# EAGLE design dc_q84_v2 (EAGLE 9.6.2)
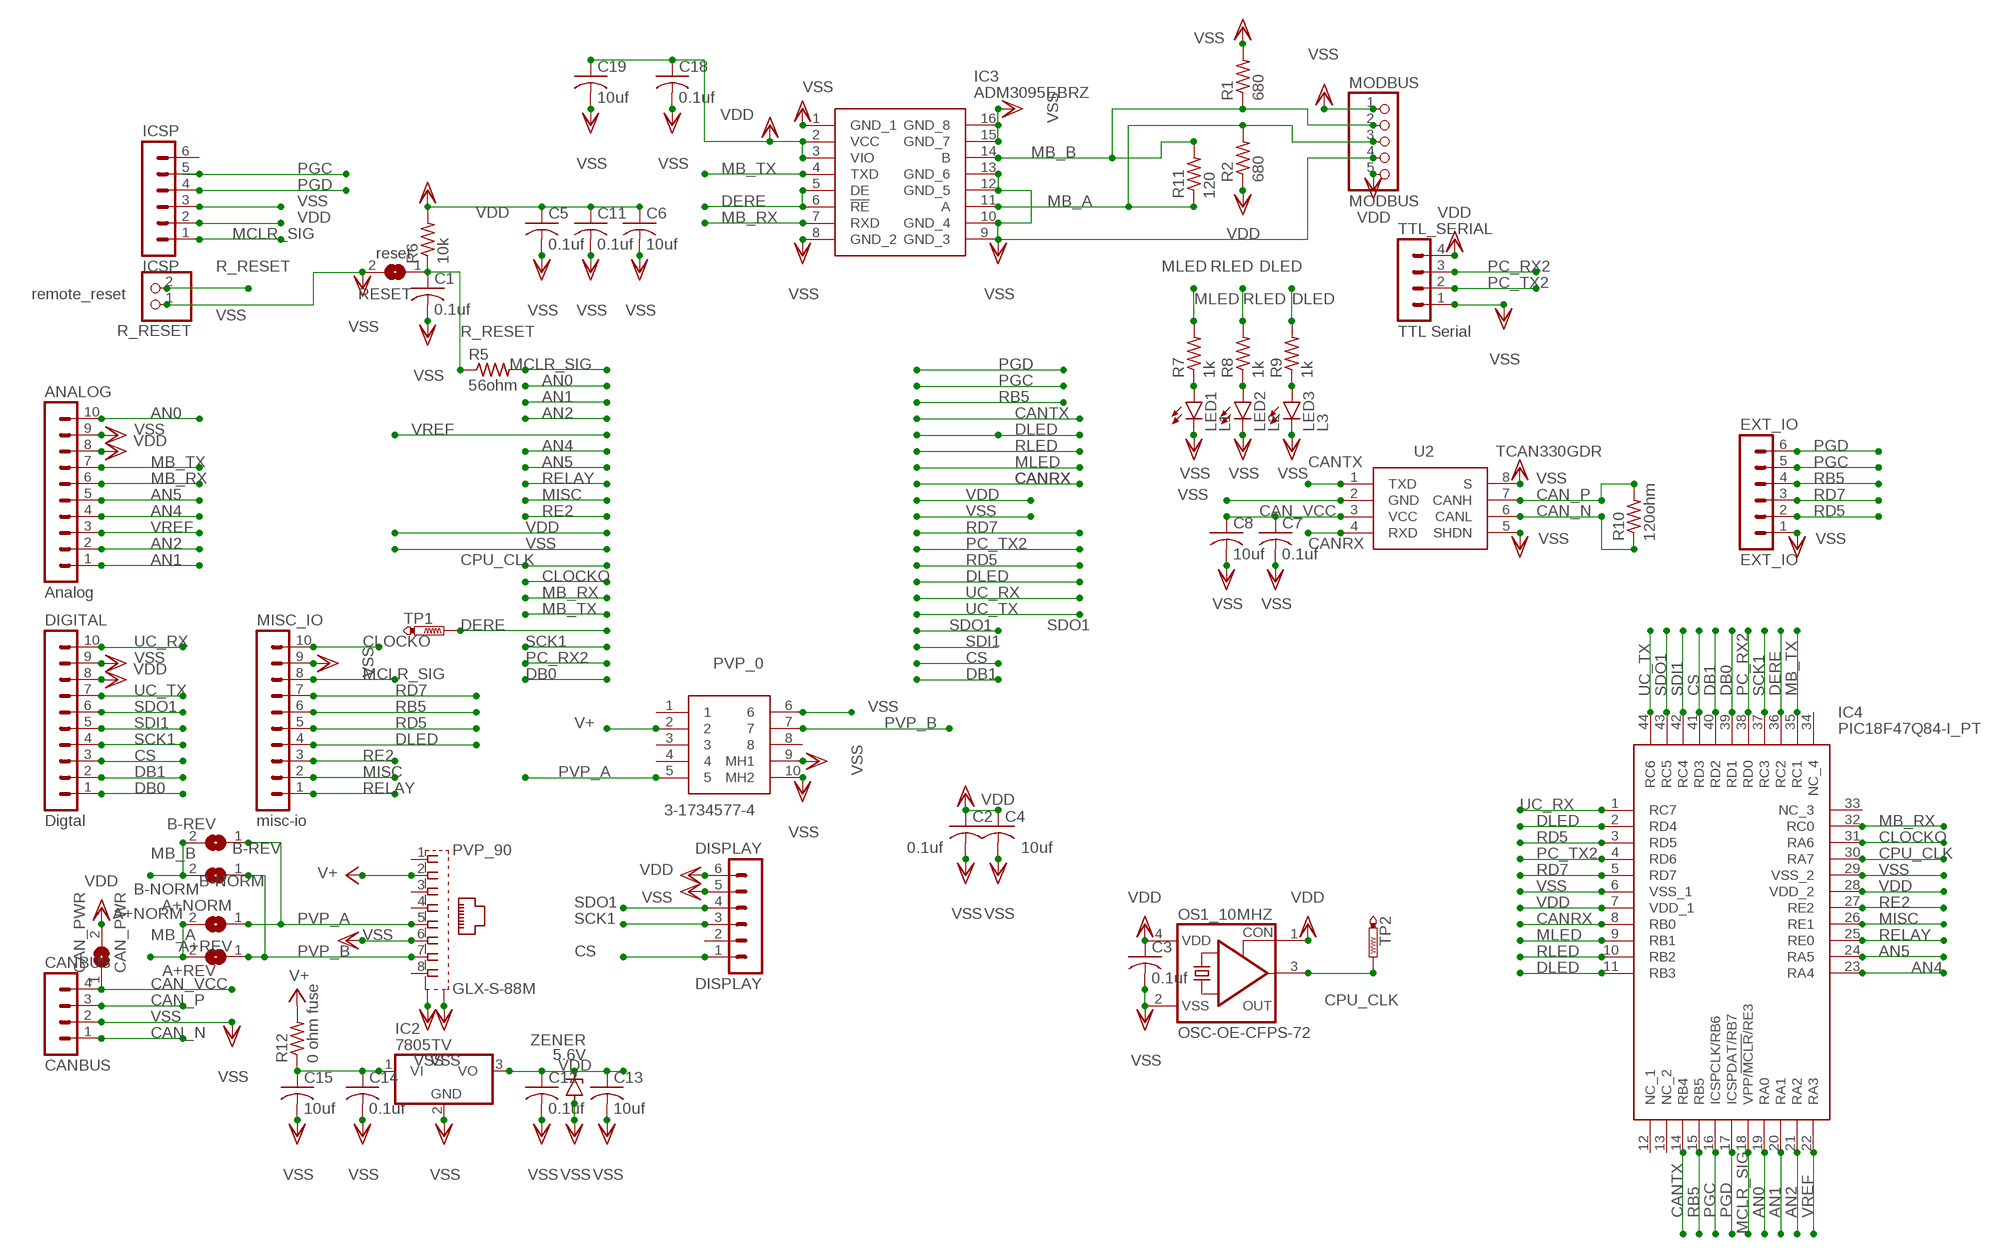
[diagram p0: schematic, sheet 1]

## Parts
A+NORM  A+NORM  SJ  [SJ]
A+REV  A+REV  SJ  [SJ]
ANALOG  Analog  MA10-1  [MA10-1]
B-NORM  B-NORM  SJ  [SJ]
B-REV  B-REV  SJ  [SJ]
C1  0.1uf  C-USC0805  [C0805]
C2  0.1uf  C-USC0805  [C0805]
C3  0.1uf  C-USC0805  [C0805]
C4  10uf  C-USC0805  [C0805]
C5  0.1uf  C-USC0805  [C0805]
C6  10uf  C-USC0805  [C0805]
C7  0.1uf  C-USC0805  [C0805]
C8  10uf  C-USC0805  [C0805]
C11  0.1uf  C-USC0805  [C0805]
C12  0.1uf  C-USC0805  [C0805]
C13  10uf  C-USC0805  [C0805]
C14  0.1uf  C-USC0805  [C0805]
C15  10uf  C-USC0805  [C0805]
C18  0.1uf  C-USC0805  [C0805]
C19  10uf  C-USC0805  [C0805]
CAN_PWR  CAN_PWR  SJ  [SJ]
CANBUS  CANBUS  MA04-1  [MA04-1]
DIGITAL  Digtal  MA10-1  [MA10-1]
DISPLAY  DISPLAY  MA06-1  [MA06-1]
EXT_IO  EXT_IO  MA06-1  [MA06-1]
IC2  7805TV  [TO220V]
IC3  ADM3095EBRZ  [SOIC127P600X175-16N]
IC4  PIC18F47Q84-I_PT  [QFP80P1200X1200X120-44N]
ICSP  ICSP  MA06-1  [MA06-1]
LED1  L1  LEDCHIPLED_0805  [CHIPLED_0805]
LED2  L2  LEDCHIPLED_0805  [CHIPLED_0805]
LED3  L3  LEDCHIPLED_0805  [CHIPLED_0805]
MISC_IO  misc-io  MA10-1  [MA10-1]
MODBUS  MODBUS  PINHD-1X5  [1X05]
OS1_10MHZ  OSC-OE-CFPS-72  [7.2X5.2-4-PAD]
PVP_0  3-1734577-4  [317345774]
PVP_90  GLX-S-88M  [GLX-S-88M]
R1  680  R-US_R0805  [R0805]
R2  680  R-US_R0805  [R0805]
R5  56ohm  R-US_R0805  [R0805]
R6  10k  R-US_R0805  [R0805]
R7  1k  R-US_R0805  [R0805]
R8  1k  R-US_R0805  [R0805]
R9  1k  R-US_R0805  [R0805]
R10  120ohm  R-US_R0805  [R0805]
R11  120  R-US_R0805  [R0805]
R12  0 ohm fuse  R-US_R1206  [R1206]
R_RESET  remote_reset  PINHD-1X2  [1X02]
RESET  reset  SJ  [SJ]
TP1  PTR1PAD1-13  [P1-13]
TP2  PTR1PAD1-13  [P1-13]
TTL_SERIAL  TTL Serial  MA04-1  [MA04-1]
U2  TCAN330GDR  [SOIC127P600X175-8N]
ZENER  5.6V  ZENER-DIODESMB  [SMB]

## Nets
AN0: ANALOG.10 IC4.19(RA0)
AN1: ANALOG.1 IC4.20(RA1)
AN2: ANALOG.2 IC4.21(RA2)
AN4: ANALOG.4 IC4.23(RA4)
AN5: ANALOG.5 IC4.24(RA5)
CAN_N: CANBUS.1 R10.1 U2.6(CANL)
CAN_P: CANBUS.3 R10.2 U2.7(CANH)
CAN_VCC: C7.1 C8.1 CAN_PWR.1 CANBUS.4 U2.3(VCC)
CANRX: IC4.8(RB0) U2.4(RXD)
CANTX: IC4.14(RB4) U2.1(TXD)
CLOCKO: IC4.31(RA6) MISC_IO.10
CPU_CLK: IC4.30(RA7) OS1_10MHZ.3(OUT) TP2.TP
CS: DIGITAL.3 DISPLAY.1 IC4.41(RD3)
DB0: DIGITAL.1 IC4.39(RD1)
DB1: DIGITAL.2 IC4.40(RD2)
DERE: IC3.5(DE) IC3.6(!RE) IC4.36(RC2) TP1.TP
DLED: IC4.2(RD4) IC4.11(RB3) MISC_IO.4 R9.2
MB_A: A+NORM.2 A+REV.2 IC3.11(A) MODBUS.3 R2.2 R11.1
MB_B: B-NORM.2 B-REV.2 IC3.14(B) MODBUS.2 R1.1 R11.2
MB_RX: ANALOG.6 IC3.7(RXD) IC4.32(RC0)
MB_TX: ANALOG.7 IC3.4(TXD) IC4.35(RC1)
MCLR_SIG: IC4.18(VPP/!MCLR!/RE3) ICSP.1 MISC_IO.8 R5.2
MISC: IC4.26(RE1) MISC_IO.2
MLED: IC4.9(RB1) R7.2
N$2: C14.1 C15.1 IC2.1(VI) R12.1
N$4: LED1.A R7.1
N$5: LED2.A R8.1
N$6: LED3.A R9.1
PC_RX2: IC4.38(RD0) TTL_SERIAL.3
PC_TX2: IC4.4(RD6) TTL_SERIAL.2
PGC: EXT_IO.5 IC4.16(ICSPCLK/RB6) ICSP.5
PGD: EXT_IO.6 IC4.17(ICSPDAT/RB7) ICSP.4
PVP_A: A+NORM.1 B-REV.1 PVP_0.5 PVP_90.5
PVP_B: A+REV.1 B-NORM.1 PVP_0.7 PVP_90.7
R_RESET: C1.1 R5.1 R6.1 R_RESET.2 RESET.1
RB5: EXT_IO.4 IC4.15(RB5) MISC_IO.6
RD5: EXT_IO.2 IC4.3(RD5) MISC_IO.5
RD7: EXT_IO.3 IC4.5(RD7) MISC_IO.7
RE2: IC4.27(RE2) MISC_IO.3
RELAY: IC4.25(RE0) MISC_IO.1
RLED: IC4.10(RB2) R8.2
SCK1: DIGITAL.4 DISPLAY.3 IC4.37(RC3)
SDI1: DIGITAL.5 IC4.42(RC4)
SDO1: DIGITAL.6 DISPLAY.4 IC4.43(RC5)
UC_RX: DIGITAL.10 IC4.1(RC7)
UC_TX: DIGITAL.7 IC4.44(RC6)
V+ [icurrent]: PVP_0.2 PVP_90.2 R12.2
VDD: ANALOG.8 C2.1 C3.1 C4.1 C5.1 C6.1 C11.1 C12.1 C13.1 C18.1 C19.1 CAN_PWR.2 DIGITAL.8 DISPLAY.6 IC2.3(VO) IC3.2(VCC) IC3.3(VIO) IC4.7(VDD_1) IC4.28(VDD_2) ICSP.2 MODBUS.5 OS1_10MHZ.1(CON) OS1_10MHZ.4(VDD) R2.1 R6.2 TTL_SERIAL.4 ZENER.C
VREF: ANALOG.3 IC4.22(RA3)
VSS: ANALOG.9 C1.2 C2.2 C3.2 C4.2 C5.2 C6.2 C7.2 C8.2 C11.2 C12.2 C13.2 C14.2 C15.2 C18.2 C19.2 CANBUS.2 DIGITAL.9 DISPLAY.5 EXT_IO.1 IC2.2(GND) IC3.1(GND_1) IC3.8(GND_2) IC3.9(GND_3) IC3.10(GND_4) IC3.12(GND_5) IC3.13(GND_6) IC3.15(GND_7) IC3.16(GND_8) IC4.6(VSS_1) IC4.29(VSS_2) ICSP.3 LED1.C LED2.C LED3.C MISC_IO.9 MODBUS.1 MODBUS.4 OS1_10MHZ.2(VSS) PVP_0.6 PVP_0.9(MH1) PVP_0.10(MH2) PVP_90.6 PVP_90.S1 PVP_90.S2 R1.2 R_RESET.1 RESET.2 TTL_SERIAL.1 U2.2(GND) U2.5(SHDN) U2.8(S) ZENER.A
Unconnected: DISPLAY.2 IC4.12(NC_1) IC4.13(NC_2) IC4.33(NC_3) IC4.34(NC_4) ICSP.6 PVP_0.1 PVP_0.3 PVP_0.4 PVP_0.8 PVP_90.1 PVP_90.3 PVP_90.4 PVP_90.8

## Library data of the parts
A+NORM A+REV B-NORM B-REV CAN_PWR RESET = jumper:SJ: SMD solder JUMPER
ANALOG DIGITAL MISC_IO = con-lstb:MA10-1: PIN HEADER; OC_FARNELL: unknown; OC_NEWARK: unknown
C1-C8 C11-C15 C18 C19 = rcl:C-US: CAPACITOR, American symbol; SPICEPREFIX: C
CANBUS TTL_SERIAL = con-lstb:MA04-1: PIN HEADER; OC_FARNELL: unknown; OC_NEWARK: unknown
DISPLAY EXT_IO ICSP = con-lstb:MA06-1: PIN HEADER; OC_FARNELL: unknown; OC_NEWARK: unknown
IC2 = linear:78*: Positive VOLTAGE REGULATOR Source: http://cache.national.com/ds/LM/LM78L05.pdf http://www.fairchildsemi.com/ds/LM/LM7805.pdf
IC3 = ADM3095EBRZ:ADM3095EBRZ: Level 4 EMC Protected RS-485 Transceiver with Full +/-42 V Fault Protection Source: Datasheet; DESCRIPTION: Level 4 EMC Protected RS-485 Transceiver with Full +/-42 V Fault Protection; HEIGHT: 1.75mm; MANUFACTURER_NAME: Analog Devices; MANUFACTURER_PART_NUMBER: ADM3095EBRZ; MOUSER_PART_NUMBER: 584-ADM3095EBRZ; MOUSER_PRICE-STOCK: https://www.mouser.com/Search/Refine.aspx?Keyword=584-ADM3095EBRZ
IC4 = PIC18F47Q84-I_PT:PIC18F47Q84-I_PT: 8-bit Microcontrollers - MCU CAN-FD, 128KB Flash, 13KB RAM, 12b ADC3, UTMR, DAC, Comp, PWM, CCP, CWG, HLT, WWDT, SCAN/CRC, ZCD, PPS,Comms IDLE/DOZE/PMD, JTAG Source: Datasheet; DESCRIPTION: 8-bit Microcontrollers - MCU CAN-FD, 128KB Flash, 13KB RAM, 12b ADC3, UTMR, DAC, Comp, PWM, CCP, CWG, HLT, WWDT, SCAN/CRC, ZCD, PPS,Comms IDLE/DOZE/PMD, JTAG; HEIGHT: 1.2mm; MANUFACTURER_NAME: Microchip; MANUFACTURER_PART_NUMBER: PIC18F47Q84-I/PT; MOUSER_PART_NUMBER: 579-PIC18F47Q84-I/PT; MOUSER_PRICE-STOCK: https://www.mouser.co.uk/ProductDetail/Microchip-Technology/PIC18F47Q84-I-PT?qs=d0WKAl%252BL4KYthTnAmf%2FYSg%3D%3D
LED1-LED3 = led:LED: LED OSRAM: - CHIPLED LG R971, LG N971, LY N971, LG Q971, LY Q971, LO R971, LY R971 LH N974, LH R974 LS Q976, LO Q976, LY Q976 LO Q996 - Hyper CHIPLED LW Q18S LB Q993, LB Q99A, LB R99A - SideLED LS A670, LO A670, LY A670, LG A670, LP A670 LB A673, LV A673, LT A673, LW A673 LH A674 LY A675 LS A676, LA A676, LO A676, LY A676, LW A676 LS A679, LY A679, LG A679 - Hyper Micro SIDELED® LS Y876, LA Y876, LO Y876, LY Y876 LT Y87S - SmartLED LW L88C, LW L88S LB L89C, LB L89S, LG L890 LS L89K, LO L89K, LY L89K LS L896, LA L896, LO L896, LY L896 - TOPLED LS T670, LO T670, LY T670, LG T670, LP T670 LSG T670, LSP T670, LSY T670, LOP T670, LYG T670 LG T671, LOG T671, LSG T671 LB T673, LV T673, LT T673, LW T673 LH T674 LS T676, LA T676, LO T676, LY T676, LB T676, LH T676, LSB T676, LW T676 LB T67C, LV T67C, LT T67C, LS T67K, LO T67K, LY T67K, LW E67C LS E67B, LA E67B, LO E67B, LY E67B, LB E67C, LV E67C, LT E67C LW T67C LS T679, LY T679, LG T679 LS T770, LO T770, LY T770, LG T770, LP T770 LB T773, LV T773, LT T773, LW T773 LH T774 LS E675, LA E675, LY E675, LS T675 LS T776, LA T776, LO T776, LY T776, LB T776 LHGB T686 LT T68C, LB T68C - Hyper Mini TOPLED® LB M676 - Mini TOPLED Santana® LG M470 LS M47K, LO M47K, LY M47K Source: http://www.osram.convergy.de LUXEON: - LUMILED® LXK2-PW12-R00, LXK2-PW12-S00, LXK2-PW14-U00, LXK2-PW14-V00 LXK2-PM12-R00, LXK2-PM12-S00, LXK2-PM14-U00 LXK2-PE12-Q00, LXK2-PE12-R00, LXK2-PE12-S00, LXK2-PE14-T00, LXK2-PE14-U00 LXK2-PB12-K00, LXK2-PB12-L00, LXK2-PB12-M00, LXK2-PB14-N00, LXK2-PB14-P00, LXK2-PB14-Q00 LXK2-PR12-L00, LXK2-PR12-M00, LXK2-PR14-Q00, LXK2-PR14-R00 LXK2-PD12-Q00, LXK2-PD12-R00, LXK2-PD12-S00 LXK2-PH12-R00, LXK2-PH12-S00 LXK2-PL12-P00, LXK2-PL12-Q00, LXK2-PL12-R00 Source: www.luxeon.com KINGBRIGHT: KA-3528ASYC Source: www.kingbright.com
MODBUS = pinhead:PINHD-1X5: PIN HEADER
OS1_10MHZ = IQD-Frequency-Products:OSC-OE: OSCILLATOR WITH OE
PVP_0 = 3-1734577-4:3-1734577-4: RJ45 Connector, Single Port, 1 x 1, Standard Connector Contact Density, Jack, Shielded, Cat 3, Standard - Latch Down, 8 Position, Standard Profile Source: Datasheet; DESCRIPTION: RJ45 Connector, Single Port, 1 x 1, Standard Connector Contact Density, Jack, Shielded, Cat 3, Standard - Latch Down, 8 Position, Standard Profile; HEIGHT: 16.8mm; MANUFACTURER_NAME: TE Connectivity; MANUFACTURER_PART_NUMBER: 3-1734577-4; MOUSER_PART_NUMBER: 571-3-1734577-4; MOUSER_PRICE-STOCK: https://www.mouser.co.uk/ProductDetail/TE-Connectivity-AMP/3-1734577-4?qs=Z4JOKa0a9TUSCOA052xCCw%3D%3D
PVP_90 = con-kycon:GLX-S-88M: Mod. Jack, Right Angle, 8 posiotion, 8 contatcs RJ45 Source: GLX-S-88M.pdf; OC_FARNELL: unknown; OC_NEWARK: unknown
R1 R2 R5-R12 = rcl:R-US_: RESISTOR, American symbol; SPICEPREFIX: R
R_RESET = pinhead:PINHD-1X2: PIN HEADER
TP1 TP2 = testpad:PTR1: TEST PIN
U2 = TCAN330GDR:TCAN330GDR: 3.3-V CAN Transceivers with CAN FD (Flexible Data Rate) Source: Datasheet; DESCRIPTION: 3.3-V CAN Transceivers with CAN FD (Flexible Data Rate); HEIGHT: 1.75mm; MANUFACTURER_NAME: Texas Instruments; MANUFACTURER_PART_NUMBER: TCAN330GDR; MOUSER_PART_NUMBER: 595-TCAN330GDR; MOUSER_PRICE-STOCK: https://www.mouser.co.uk/ProductDetail/Texas-Instruments/TCAN330GDR?qs=9DwIlvx97adeWwzxdqwSPw%3D%3D
ZENER = diode:ZENER-DIODE: Z-Diode

## Net classes
1 icurrent: width 0.305 mm

## Board
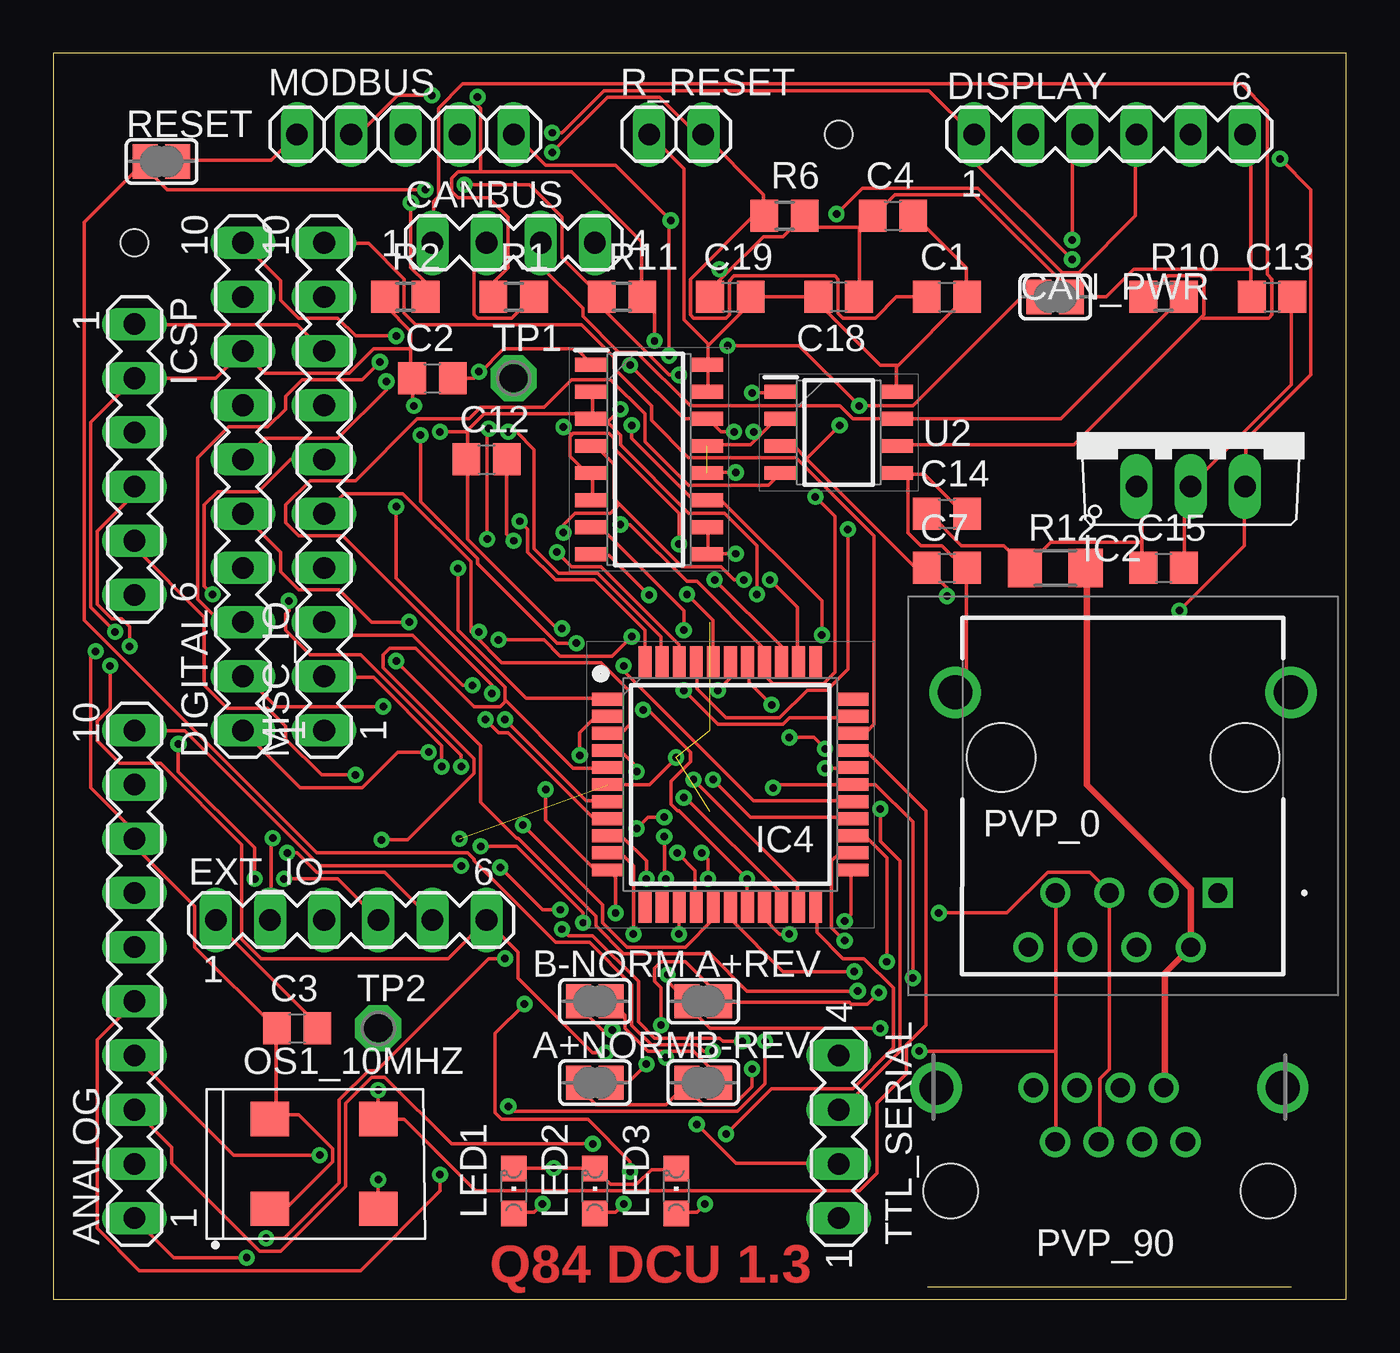
[diagram p1: board, top side]
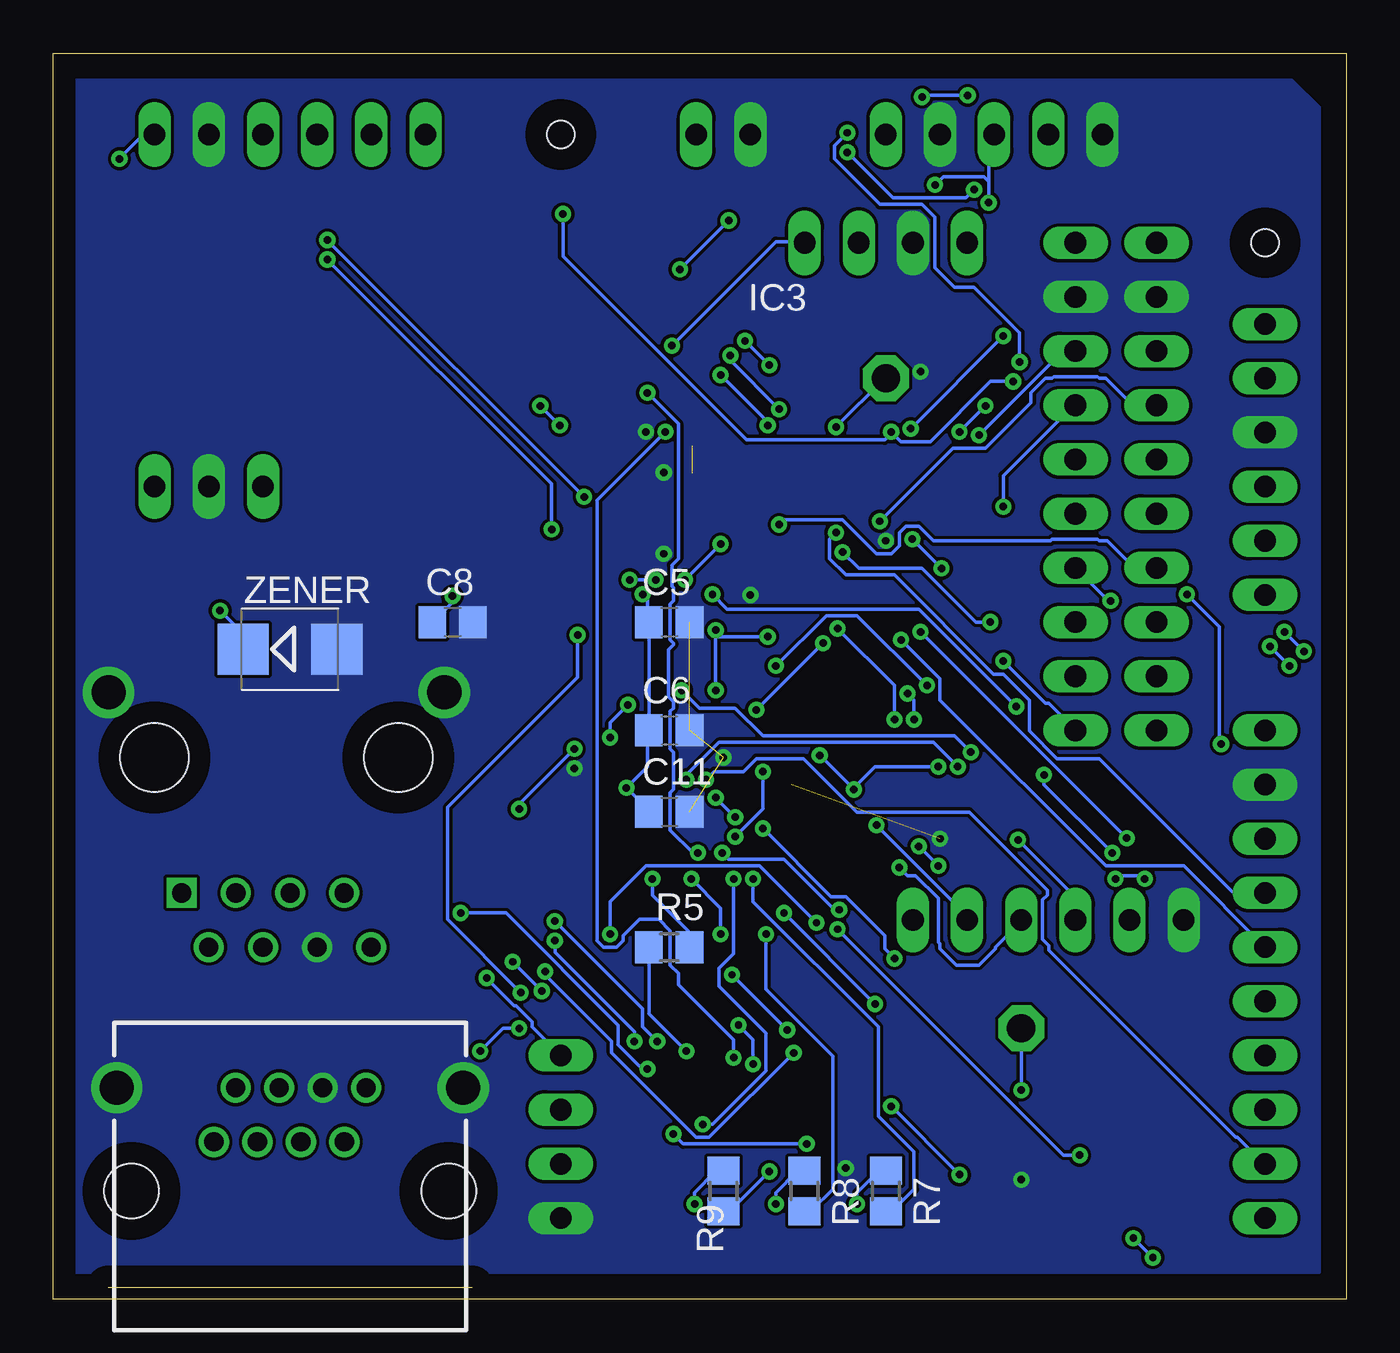
[diagram p2: board, bottom side, seen from below]

Size 60.63 x 58.41 mm. Coordinates in mm from the lower left corner, seen from the top.
Outline: 0,0 60.63,0 60.63,58.41 0,58.41 0,0
Copper layers (1*16): Top 0.035mm / dielectric 1.5mm / Bottom 0.035mm
Design rules "default": minimum track width 6mil, minimum drill 0.35mm, track to track 6mil, track to pad 6mil, pad to pad 6mil, via to via 6mil, smd to smd 6mil, copper to edge 40mil, drill to drill 6mil, minimum pad ring 10mil, minimum via ring 8mil, stop-mask expansion 4mil, vias tented up to drill 0mil, thermal gap 10mil
Holes 1.27 mm at 36.83,54.61 3.81,49.53

### Footprints (pad centres in the part's own frame; a part is rotated, then mirrored left to right if it is on the bottom)
SJ = smd 1.168 x 1.6: 1 -0.762,0; 2 0.762,0
MA10-1 = drill 1.016 long: 1 -11.43,0; 2 -8.89,0; 3 -6.35,0; 4 -3.81,0; 5 -1.27,0; 6 1.27,0; 7 3.81,0; 8 6.35,0; 9 8.89,0; 10 11.43,0
C0805 = smd 1.3 x 1.5: 1 -0.95,0; 2 0.95,0
MA04-1 = drill 1.016 long: 1 -3.81,0; 2 -1.27,0; 3 1.27,0; 4 3.81,0
MA06-1 = drill 1.016 long: 1 -6.35,0; 2 -3.81,0; 3 -1.27,0; 4 1.27,0; 5 3.81,0; 6 6.35,0
TO220V = drill 1.016 long: 1 -2.54,-2.54; 2 0,-2.54; 3 2.54,-2.54
SOIC127P600X175-16N = smd 1.525 x 0.65: 1 -2.712,4.445; 2 -2.712,3.175; 3 -2.712,1.905; 4 -2.712,0.635; 5 -2.712,-0.635; 6 -2.712,-1.905; 7 -2.712,-3.175; 8 -2.712,-4.445; 9 2.712,-4.445; 10 2.712,-3.175; 11 2.712,-1.905; 12 2.712,-0.635; 13 2.712,0.635; 14 2.712,1.905; 15 2.712,3.175; 16 2.712,4.445
QFP80P1200X1200X120-44N = smd 1.475 x 0.6: 1 -5.738,4; 2 -5.738,3.2; 3 -5.738,2.4; 4 -5.738,1.6; 5 -5.738,0.8; 6 -5.738,0; 7 -5.738,-0.8; 8 -5.738,-1.6; 9 -5.738,-2.4; 10 -5.738,-3.2; 11 -5.738,-4; 23 5.738,-4; 24 5.738,-3.2; 25 5.738,-2.4; 26 5.738,-1.6; 27 5.738,-0.8; 28 5.738,0; 29 5.738,0.8; 30 5.738,1.6; 31 5.738,2.4; 32 5.738,3.2; 33 5.738,4 | smd 0.6 x 1.475: 12 -4,-5.738; 13 -3.2,-5.738; 14 -2.4,-5.738; 15 -1.6,-5.738; 16 -0.8,-5.738; 17 0,-5.738; 18 0.8,-5.738; 19 1.6,-5.738; 20 2.4,-5.738; 21 3.2,-5.738; 22 4,-5.738; 34 4,5.738; 35 3.2,5.738; 36 2.4,5.738; 37 1.6,5.738; 38 0.8,5.738; 39 0,5.738; 40 -0.8,5.738; 41 -1.6,5.738; 42 -2.4,5.738; 43 -3.2,5.738; 44 -4,5.738
CHIPLED_0805 = smd 1.2 x 1.2: A 0,-1.05; C 0,1.05
1X05 = drill 1.016 long: 1 -5.08,0; 2 -2.54,0; 3 0,0; 4 2.54,0; 5 5.08,0
7.2X5.2-4-PAD = smd 1.8 x 1.6: 1 -2.54,-2.1; 2 2.54,-2.1; 3 2.54,2.1; 4 -2.54,2.1
317345774 = drill 0.9 pad 1.4 square: 1 0,0 | drill 0.9 pad 1.4: 2 -1.27,-2.54; 3 -2.54,0; 4 -3.81,-2.54; 5 -5.08,0; 6 -6.35,-2.54; 7 -7.62,0; 8 -8.89,-2.54 | drill 1.6 pad 2.4: 9 3.43,9.4; 10 -12.32,9.4 | hole 3.2: 1.27,6.35; -10.16,6.35
GLX-S-88M = drill 0.9 pad 1.422: 1 -3.57,-2.3; 2 -2.55,-4.84; 3 -1.53,-2.3; 4 -0.51,-4.84; 5 0.51,-2.3; 6 1.53,-4.84; 7 2.55,-2.3; 8 3.57,-4.84 | drill 1.6 pad 2.184: S1 -8.125,-4.84; S2 8.125,-4.84 | hole 2.55: -7.44,0; 7.44,0
R0805 = smd 1.3 x 1.5: 1 -0.95,0; 2 0.95,0
R1206 = smd 1.6 x 1.803: 1 -1.422,0; 2 1.422,0
1X02 = drill 1.016 long: 1 -1.27,0; 2 1.27,0
P1-13 = drill 1.321 pad 2.159 octagon: TP 0,0
SOIC127P600X175-8N = smd 1.528 x 0.65: 1 -2.711,1.905; 2 -2.711,0.635; 3 -2.711,-0.635; 4 -2.711,-1.905; 5 2.711,-1.905; 6 2.711,-0.635; 7 2.711,0.635; 8 2.711,1.905
SMB = smd 2.4 x 2.4: A 2.2,0; C -2.2,0

### Placement (x,y rotation side)
A+NORM  25.4,10.16 0 top
A+REV  30.48,13.97 0 top
ANALOG  3.81,15.24 90 top
B-NORM  25.4,13.97 0 top
B-REV  30.48,10.16 0 top
C1  41.91,46.99 0 top
C2  17.78,43.18 0 top
C3  11.43,12.7 0 top
C4  39.37,50.8 0 top
C5  31.75,31.75 0 bottom
C6  31.75,26.67 0 bottom
C7  41.91,34.29 0 top
C8  41.91,31.75 0 bottom
C11  31.75,22.86 0 bottom
C12  20.32,39.37 0 top
C13  57.15,46.99 0 top
C14  41.91,36.83 0 top
C15  52.07,34.29 0 top
C18  36.83,46.99 180 top
C19  31.75,46.99 0 top
CAN_PWR  46.99,46.99 0 top
CANBUS  21.59,49.53 0 top
DIGITAL  8.89,38.1 90 top
DISPLAY  49.53,54.61 0 top
EXT_IO  13.97,17.78 0 top
IC2  53.34,40.64 0 top
IC3  27.94,39.37 0 top
IC4  31.75,24.13 0 top
ICSP  3.81,39.37 270 top
LED1  21.59,5.08 0 top
LED2  25.4,5.08 0 top
LED3  29.21,5.08 0 top
MISC_IO  12.7,38.1 90 top
MODBUS  16.51,54.61 0 top
OS1_10MHZ  12.7,6.35 0 top
PVP_0  54.61,19.05 0 top
PVP_90  49.53,5.08 180 top
R1  21.59,46.99 0 top
R2  16.51,46.99 0 top
R5  31.75,16.51 0 bottom
R6  34.29,50.8 0 top
R7  21.59,5.08 270 bottom
R8  25.4,5.08 270 bottom
R9  29.21,5.08 270 bottom
R10  52.07,46.99 0 top
R11  26.67,46.99 0 top
R12  46.99,34.29 0 top
R_RESET  29.21,54.61 0 top
RESET  5.08,53.34 0 top
TP1  21.59,43.18 0 top
TP2  15.24,12.7 0 top
TTL_SERIAL  36.83,7.62 90 top
U2  36.83,40.64 0 top
ZENER  49.53,30.48 0 bottom

### Tracks (layer width: path | path; a pad name or v marks a point on that pad's centre or on a via)
AN0  (via drill 0.35)
  Top 0.152: v34.52,17.12 34.06,17.12 33.38,17.81 33.38,18.34 IC4.19 | v24.84,17.65 24.84,18.11 21.72,21.23 v20.04,21.23 | v19.13,20.32 12.5,20.32 6.17,26.64 3.81,26.64 ANALOG.10
  Bottom 0.152: v34.52,17.12 34.52,18.64 32.84,20.32 27.51,20.32 v24.84,17.65 | v19.13,20.32 v20.04,21.23
AN1  (via drill 0.35)
  Top 0.152: v29.57,23.52 29.64,23.52 34.14,19.03 34.14,18.42 IC4.20 | v28.65,22.61 27.89,22.61 v27.36,22.07 | v21.18,15.98 20.42,15.98 15.16,10.72 14.78,10.72 13.41,9.35 13.41,5.46 10.82,2.87 v9.98,2.87 | v9.07,1.96 5.64,1.96 3.81,3.79 ANALOG.1
  Bottom 0.152: v28.65,22.61 v29.57,23.52 | v27.36,22.07 24.16,18.87 23.47,18.87 21.64,17.04 21.64,16.43 v21.18,15.98 | v9.07,1.96 v9.98,2.87
AN2  (via drill 0.35)
  Top 0.152: v30.02,24.36 34.9,19.48 34.9,18.42 IC4.21
  Bottom 0.152: v30.02,24.36 29.64,24.74 28.27,24.74 27.66,25.35 25.45,25.35 22.94,22.83 17.68,22.83 14.02,19.18 14.02,18.95 14.25,18.72 14.25,16.89 13.95,16.59 13.95,16.36 5.18,7.59 5.11,7.59 3.81,6.3 ANALOG.2
AN4  (via drill 0.35)
  Top 0.152: v37.11,17.73 37.41,18.03 37.41,20.09 IC4.23 | v32.31,12.09 31.39,12.09 31.24,12.24 28.19,12.24 27.43,13 27.43,14.91 25.3,17.04 24.16,17.04 v23.85,17.35 | v12.5,6.76 8.46,6.76 3.81,11.4 ANALOG.4
  Bottom 0.152: v37.11,17.73 32.99,13.61 32.99,12.78 v32.31,12.09 | v23.85,17.35 13.26,6.76 v12.5,6.76
AN5  (via drill 0.35)
  Top 0.152: v37.11,16.82 36.5,17.42 36.5,20.55 36.88,20.93 37.41,20.93 IC4.24 | v33.38,12.09 33.38,10.11 32.08,8.81 21.57,8.81 v21.34,9.04 | v18.14,5.84 18.14,5.08 14.4,1.35 4.04,1.35 2.06,3.33 2.06,12.17 3.81,13.92 ANALOG.5
  Bottom 0.152: v37.11,16.82 37.11,16.28 33.38,12.55 v33.38,12.09 | v18.14,5.84 v21.34,9.04
CAN_N
  Top 0.152: R10.1 51.28,46.99 52.27,47.98 53.8,47.98 53.95,47.83 53.95,46.15 53.84,46.04 | 53.84,46.04 47.85,40.06 39.55,40.06 U2.6 | CANBUS.1 17.83,49.58 17.83,51.49 18.06,51.71 18.06,55.83 19.2,56.97 55.7,56.97 56.92,55.75 56.92,48.06 57.15,47.83 57.15,46.15 57,46 53.87,46 53.84,46.04
CAN_P
  Top 0.152: R10.2 52.96,46.99 47.24,41.28 U2.7 37.49,41.28 36.88,41.89 29.87,41.89 27.36,44.4 26.52,44.4 24.84,46.08 24.84,46.46 22.86,48.44 CANBUS.3
CAN_VCC  (via drill 0.35)
  Top 0.152: 35.32,39.41 34.75,39.98 34.14,39.98 U2.3 | 35.32,39.41 40.39,34.34 40.92,34.34 C7.1 41,34.27 41.91,33.35 v41.91,32.97 | CAN_PWR.1 45.41,46.99 40.31,41.89 v37.8,41.89 34.98,44.7 v31.62,44.7 | 35.32,39.41 v36.88,40.97
  Bottom 0.152: v41.91,32.97 41.76,32.82 42.82,31.75 C8.1 | v36.88,40.97 v37.8,41.89 | v31.62,44.7 26.75,49.58 25.45,49.58 CANBUS.4
CANRX  (via drill 0.35)
  Top 0.152: v20.27,27.18 20.88,26.57 21.34,26.57 25.3,22.61 25.98,22.61 IC4.8 | v20.57,28.4 20.57,28.78 13.56,35.79 11.51,35.79 10.9,36.4 10.9,37.24 12.04,38.38 14.17,38.38 17.07,41.28 19.51,41.28 20.04,41.81 23.01,41.81 24.31,43.1 26.14,43.1 27.74,41.5 27.74,40.21 29.79,38.15 33.53,38.15 34.06,38.68 U2.4
  Bottom 0.152: v20.27,27.18 20.27,28.09 v20.57,28.4
CANTX  (via drill 0.35)
  Top 0.152: v29.34,17.12 29.34,18.34 IC4.14 | v30.71,19.71 30.71,20.63 v30.4,20.93 | v32.77,42.49 34.06,42.49 U2.1
  Bottom 0.152: v29.34,17.12 29.34,18.34 v30.71,19.71 | v30.4,20.93 30.63,20.93 31.7,22 31.7,23.75 31.55,23.9 31.55,25.65 31.7,25.81 31.7,27.56 31.55,27.71 31.55,28.02 31.77,28.25 31.77,30.46 31.55,30.68 31.55,30.76 31.7,30.91 31.7,32.59 31.55,32.74 31.55,33.35 31.62,33.43 31.62,34.42 31.32,34.72 31.32,41.05 v32.77,42.49
CLOCKO
  Top 0.152: IC4.31 37.49,26.57 38.1,26.57 38.48,26.95 38.48,35.79 34.82,39.45 29.79,39.45 28.04,41.2 28.04,41.89 26.29,43.64 26.29,44.17 24.77,45.69 16.99,45.69 16.46,46.23 16.46,47.83 14.78,49.5 12.72,49.5 MISC_IO.10
CPU_CLK  (via drill 0.35)
  Top 0.152: IC4.30 37.49,25.65 38.18,25.65 40.92,22.91 40.92,12.85 40.01,11.94 40.01,10.57 38.63,9.2 38.63,5.92 37.8,5.08 19.81,5.08 16.46,8.43 15.24,8.43 OS1_10MHZ.3 v15.24,9.8
  Bottom 0.152: v15.24,9.8 TP2.TP
CS  (via drill 0.35)
  Top 0.152: v37.26,36.09 37.26,29.54 36.27,28.55 35.36,28.55 34.06,27.25 31.55,27.25 30.18,28.63 30.18,29.85 IC4.41 | v47.78,48.74 43.2,53.31 43.2,54.61 DISPLAY.1 43.13,54.61 41.07,56.67 25.83,56.67 23.85,54.69 v23.39,54.69 | DIGITAL.3 7.85,31.75 6.78,32.82 6.78,39.45 8.23,40.89 10.06,40.89 10.9,41.73 10.9,42.34 11.66,43.1 14.48,43.1 v15.32,43.94
  Bottom 0.152: v37.26,36.09 37.26,38.23 v47.78,48.74 | v15.32,43.94 15.32,45.31 17.45,47.45 18.36,47.45 19.28,48.36 19.28,50.72 19.89,51.33 21.87,51.33 24,53.47 24,54.08 v23.39,54.69
DB0  (via drill 0.35)
  Top 0.152: v31.17,28.55 31.7,29.08 31.7,29.85 IC4.39 | v17.6,25.65 16.15,25.65 14.48,23.98 11.58,23.98 DIGITAL.1
  Bottom 0.152: v31.17,28.55 30.33,27.71 28.65,27.71 27.36,26.42 18.36,26.42 v17.6,25.65
DB1  (via drill 0.35)
  Top 0.152: v29.72,33.05 30.94,31.83 30.94,29.92 IC4.40 | v15.47,27.79 10.44,27.79 9.07,29.16 8.91,29.16 DIGITAL.2
  Bottom 0.152: v29.72,33.05 29.03,32.36 20.04,32.36 v15.47,27.79
DERE  (via drill 0.35)
  Top 0.152: v31.01,33.73 34.14,30.61 34.14,29.92 IC4.36 | v29.34,35.41 29.34,36.86 26.29,39.9 26.29,40.36 26.06,40.59 24.38,40.59 24.31,40.51 | 24.31,40.51 24.23,40.44 24.23,39.52 24.99,38.76 25.22,38.76 IC3.5 25.3,38.68 25.3,37.47 IC3.6 | 24.31,40.51 v23.93,40.89
  Bottom 0.152: v29.34,35.41 v31.01,33.73 | v23.93,40.89 21.64,43.18 TP1.TP
DLED  (via drill 0.35)
  Top 0.152: v23.09,23.9 23.09,22.45 25.38,20.17 25.98,20.17 IC4.11 26.06,20.09 26.36,19.79 v26.36,18.11 | v24.69,25.5 24.69,26.57 25.38,27.25 25.98,27.25 IC4.2 | v27.05,5.99 27.05,6.45 25.07,8.43 21.03,8.43 20.73,8.74 20.73,12.47 v22.1,13.84 | v11.05,32.74 11.05,32.28 10.9,32.13 10.9,31.37 12.04,30.23 14.4,30.23 19.13,25.5 v19.13,24.97
  Bottom 0.152: v24.69,25.5 v23.09,23.9 23.09,23.98 22.1,24.97 v19.13,24.97 | v27.05,5.99 28.88,4.17 29.18,4.17 R9.2 | v26.36,18.11 v22.1,13.84 | v11.05,32.74 11.28,32.97 11.35,32.97 12.65,34.27 MISC_IO.4
MB_A  (via drill 0.35)
  Top 0.152: v27.81,11.02 26.98,10.18 26.21,10.18 A+NORM.2 | v28.5,12.85 28.5,14.61 28.19,14.91 28.19,15.52 28.5,15.82 29.64,15.82 31.24,14.22 A+REV.2 31.24,13.92 37.34,13.92 37.41,13.84 38.18,13.84 v38.71,14.38 | v16.76,51.41 16.76,48.36 17.45,47.68 R2.2 | v19.28,52.25 22.33,52.25 23.85,50.72 23.85,48.82 25.68,46.99 R11.1 25.76,46.99 25.76,46.46 28.88,43.33 v29.34,43.33 | v27.13,40.97 27.13,40.36 30.02,37.47 IC3.11 31.32,37.47 36.04,32.74 v36.04,31.14
  Bottom 0.152: v27.81,11.02 27.81,12.17 v28.5,12.85 | 16.76,52.4 16.76,54.38 16.54,54.61 MODBUS.3 | 16.76,52.4 v16.76,51.41 | v19.28,52.25 18.9,52.63 16.99,52.63 16.76,52.4 | v27.13,40.97 27.13,41.12 v29.34,43.33 | v38.71,14.38 42.14,17.81 42.14,23.06 36.04,29.16 v36.04,31.14
MB_B  (via drill 0.35)
  Top 0.152: B-REV.2 31.24,10.41 30.02,11.63 28.73,11.63 | 28.73,11.63 27.89,11.63 26.82,12.7 26.82,13.31 B-NORM.2 | 20.04,52.86 24.31,52.86 27.58,49.58 27.58,46.99 R11.2 27.66,46.99 28.19,46.46 v28.19,44.93 | 20.04,52.86 18.97,52.86 18.67,52.55 18.67,51.94 18.97,51.64 20.42,51.64 21.34,50.72 21.34,48.36 20.65,47.68 R1.1 | v27.05,43.79 29.57,41.28 IC3.14 30.71,41.28 31.32,40.67 v31.93,40.67 | MODBUS.2 14.33,54.61 16.15,56.44 v17.75,56.44 | v19.89,56.36 19.89,55.98 20.04,55.83 20.04,52.86 | v28.73,11.33 28.73,11.63
  Bottom 0.152: v28.19,44.93 v27.05,43.79 | v17.75,56.44 19.81,56.44 v19.89,56.36 | v28.73,11.33 28.73,12.17 31.32,14.76 31.32,15.29 31.7,15.67 31.7,17.27 32.23,17.81 33.15,17.81 33.91,17.04 33.91,16.82 34.21,16.51 34.82,16.51 35.13,16.82 35.13,37.47 v31.93,40.67
MB_RX  (via drill 0.35)
  Top 0.152: v29.57,28.55 31.17,26.95 34.21,26.95 34.52,27.25 37.41,27.25 IC4.32 | v29.57,31.37 29.57,32.28 25.68,36.17 25.3,36.17 IC3.7 | v20.88,30.91 23.01,30.91 23.77,30.15 26.21,30.15 v27.13,31.06
  Bottom 0.152: 29.57,31.06 v29.57,28.55 | ANALOG.6 7.62,20.32 11.28,20.32 19.05,28.09 19.05,29.08 v20.88,30.91 | 29.57,31.06 v27.13,31.06 | 29.57,31.06 v29.57,31.37
MB_TX  (via drill 0.35)
  Top 0.152: v33.6,33.73 34.9,32.44 34.9,29.92 IC4.35 | v32.38,33.73 31.93,33.73 31.32,34.34 29.49,34.34 26.56,37.27 | 26.56,37.27 26.29,37.54 26.29,39.14 25.45,39.98 25.3,39.98 IC3.4 | v23.93,35.94 23.93,36.32 24.46,36.86 26.14,36.86 26.56,37.27
  Bottom 0.152: v32.38,33.73 v33.6,33.73 | v23.93,35.94 24.23,35.64 24.23,34.72 23.47,33.96 21.18,33.96 16.54,29.31 16.08,29.31 14.86,28.09 14.86,26.64 13.56,25.35 11.58,25.35 5.33,19.1 3.81,19.1 ANALOG.7
MCLR_SIG  (via drill 0.35)
  Top 0.152: IC4.18 32.54,18.42 v32.54,19.71 29.34,22.91 29.26,22.91 28.96,23.22 28.96,24.28 29.87,25.2 29.87,25.65 27.89,27.64 v27.66,27.64 | v24.54,30.76 23.62,30.76 19.89,34.49 19.89,34.72 17.22,37.39 v17.22,40.51 | ICSP.1 3.81,45.69 11.43,45.69 12.65,44.47 MISC_IO.8
  Bottom 0.152: v32.54,19.71 32.54,18.95 30.86,17.27 30.86,16.51 R5.2 | v24.54,30.76 v27.66,27.64 | v17.22,40.51 13.34,44.4 12.72,44.4 MISC_IO.8
MISC  (via drill 0.35)
  Top 0.152: v30.94,24.36 32.69,22.61 37.41,22.61 IC4.26 | v18.21,24.97 18.21,25.96 15.01,29.16 12.72,29.16 MISC_IO.2
  Bottom 0.152: v30.94,24.36 30.94,24.59 29.41,26.11 19.36,26.11 v18.21,24.97
MLED  (via drill 0.35)
  Top 0.152: v27.81,19.71 27.81,20.55 26.67,21.69 26.06,21.69 IC4.9
  Bottom 0.152: v27.81,19.71 27.81,18.64 21.95,12.78 21.95,8.59 20.27,6.91 20.27,5.16 21.26,4.17 21.57,4.17 R7.2
N$2
  Top 0.152: 51.05,35.48 51.05,37.85 IC2.1 | 51.05,35.48 51.05,34.34 C15.1 | C14.1 41,36.78 41.15,36.78 42.6,35.33 44.58,35.33 45.57,34.34 R12.1 45.64,34.34 46.79,35.48 51.05,35.48
N$4  (via drill 0.35)
  Top 0.152: v22.94,4.47 22.55,4.09 21.64,4.09 LED1.A
  Bottom 0.152: v22.94,4.47 22.94,5 21.95,5.99 21.64,5.99 R7.1
N$5  (via drill 0.35)
  Top 0.152: v26.75,4.47 26.36,4.09 25.45,4.09 LED2.A
  Bottom 0.152: v26.75,4.47 26.75,5 25.76,5.99 25.45,5.99 R8.1
N$6  (via drill 0.35)
  Top 0.152: v30.56,4.47 30.18,4.09 29.26,4.09 LED3.A
  Bottom 0.152: v30.56,4.47 30.56,5 29.57,5.99 29.26,5.99 R9.1
PC_RX2  (via drill 0.35)
  Top 0.152: v33.68,27.86 32.61,28.93 32.61,29.85 IC4.38 | v34.52,26.34 35.66,26.34 v36.2,25.81 | v38.79,22.99 38.79,21.46 39.7,20.55 39.7,11.63 36.96,8.89 TTL_SERIAL.3
  Bottom 0.152: v33.68,27.86 34.52,27.03 v34.52,26.34 | v36.2,25.81 38.79,23.22 v38.79,22.99
PC_TX2  (via drill 0.35)
  Top 0.152: v27.36,24.74 27.36,24.97 26.67,25.65 26.06,25.65 IC4.4 | v28.65,21.69 28.65,19.79 v28.73,19.71 | v30.18,8.2 32,6.38 36.8,6.38 TTL_SERIAL.2
  Bottom 0.152: v27.36,24.74 27.36,22.99 v28.65,21.69 | v28.73,19.71 28.73,16.21 29.41,15.52 29.41,14.68 27.2,12.47 27.2,10.72 29.72,8.2 v30.18,8.2
PGC  (via drill 0.35)
  Top 0.152: v22.02,22.22 25.76,18.49 25.76,17.65 26.9,16.51 29.64,16.51 30.94,17.81 30.94,18.34 IC4.16 | ICSP.5 3.81,35.25 7.09,31.98 7.09,28.78 8.15,27.71 10.06,27.71 10.9,26.87 10.9,26.26 12.57,24.59 v14.17,24.59 | v10.97,20.93 11.43,20.93 12.34,20.01 15.54,20.01 EXT_IO.5
  Bottom 0.152: v22.02,22.22 17.83,18.03 17.83,17.81 EXT_IO.5 | v14.17,24.59 14.17,24.13 v10.97,20.93
PGD  (via drill 0.35)
  Top 0.152: v37.57,15.37 34.21,15.37 31.77,17.81 31.77,18.34 IC4.17 | v25.91,11.56 25.3,11.56 21.79,15.06 21.79,16.28 20.34,17.73 EXT_IO.6 18.52,15.98 9.75,15.98 8.84,16.89 8.84,21.31 5.03,25.12 3.12,25.12 2.06,26.19 2.06,27.1 2.67,27.71 v2.67,29.69 | ICSP.4 3.81,37.77 2.06,36.02 2.06,32.59 2.74,31.9 3.2,31.9 3.58,31.52 v3.58,30.61
  Bottom 0.152: v37.57,15.37 37.57,15.21 34.44,12.09 34.44,11.56 30.48,7.59 29.87,7.59 v25.91,11.56 | v2.67,29.69 v3.58,30.61
PVP_A  (via drill 0.35)
  Top 0.152: A+NORM.1 24.69,10.11 24.69,9.88 25.45,9.12 28.73,9.12 29.72,10.11 B-REV.1 29.64,9.96 30.48,9.12 31.93,9.12 32.77,9.96 v32.77,10.79 | PVP_90.5 49.07,7.44 49.07,10.34 49.53,10.79 PVP_0.5 49.53,19.1 48.62,20.01 46.63,20.01 44.73,18.11 v41.53,18.11
  Bottom 0.152: v32.77,10.79 32.99,10.79 34.14,11.94 34.14,12.85 39.4,18.11 v41.53,18.11
PVP_B  (via drill 0.35)
  Top 0.152: v26.21,12.62 25.76,12.62 24.69,13.69 24.69,13.92 B-NORM.1 | v28.8,15.21 28.8,14.91 29.72,14 A+REV.1 29.72,13.77 30.79,12.7 v38.79,12.7 | 47.02,11.63 47.02,7.44 PVP_90.7 | 47.02,11.63 47.02,19.03 PVP_0.7 | 47.02,11.63 v40.62,11.63
  Bottom 0.152: v28.8,15.21 v26.21,12.62 | v38.79,12.7 39.55,12.7 v40.62,11.63
R_RESET  (via drill 0.35)
  Top 0.152: 33.3,50.8 33.3,51.79 R_RESET.2 30.18,54.61 28.42,56.36 25.98,56.36 v23.39,53.77 | C1.1 39.55,46.99 38.56,46 37.03,46 36.8,46.23 36.8,47.83 36.65,47.98 31.93,47.98 31.7,47.75 31.7,46.15 31.55,46 30.02,46 29.87,46.15 29.87,47.83 32.84,50.8 33.3,50.8 | 33.3,50.8 R6.1 | v30.94,11.63 30.48,11.63 30.18,11.94 28.04,11.94 27.13,12.85 27.13,14.76 25.15,16.74 23.55,16.74 19.74,20.55 19.74,20.63 19.43,20.93 12.34,20.93 1.45,31.83 1.45,50.49 4.27,53.31 RESET.1 4.19,53.16 5.33,52.02 v17.45,52.02
  Bottom 0.152: v30.94,11.63 32.69,13.39 R5.1 | v23.39,53.77 21.26,51.64 17.83,51.64 v17.45,52.02
RB5  (via drill 0.35)
  Top 0.152: v29.26,20.93 30.1,20.09 30.1,18.42 IC4.15 | v23.77,18.26 22.94,18.26 v20.95,20.24 | MISC_IO.6 11.12,39.37 9.6,37.85 7.7,37.85 7.09,37.24 7.09,33.43 v7.47,33.05 | v5.87,26.04 5.87,24.74 9.45,21.16 v9.45,19.71 | v10.82,19.71 13.34,19.71 15.24,17.81 EXT_IO.4
  Bottom 0.152: v29.26,20.93 28.96,20.63 26.36,20.63 24,18.26 v23.77,18.26 | v20.95,20.24 20.57,19.86 20.19,19.86 19.13,18.8 19.13,16.74 19.05,16.66 19.05,16.43 18.29,15.67 17.22,15.67 16.46,16.43 16.46,16.51 15.24,17.73 EXT_IO.4 | v7.47,33.05 5.94,31.52 5.94,26.11 v5.87,26.04 | v9.45,19.71 9.6,19.86 10.67,19.86 v10.82,19.71
RD5  (via drill 0.35)
  Top 0.152: 19.77,31.1 19.58,31.29 19.58,34.57 16.38,37.77 13.64,37.77 MISC_IO.5 | 19.77,31.1 21.03,29.85 25.68,29.85 27.05,28.47 27.05,26.95 26.67,26.57 26.06,26.57 IC4.3 | v10.29,21.61 10.21,21.54 10.21,17.81 EXT_IO.2 | 19.77,31.1 v19.96,31.29
  Bottom 0.152: v19.96,31.29 v10.29,21.61
RD7  (via drill 0.35)
  Top 0.152: 21.22,28.05 21.18,28.09 21.18,28.7 16.08,33.81 v16.08,37.16 | 21.22,28.05 24.38,24.89 25.98,24.89 IC4.5 | v15.39,21.54 16.61,21.54 19.74,24.66 19.74,25.35 15.47,29.62 15.47,30.23 15.77,30.53 16.99,30.53 19.74,27.79 20.95,27.79 21.22,28.05
  Bottom 0.152: v16.08,37.16 16.08,38.61 12.72,41.96 MISC_IO.7 | v15.39,21.54 12.72,18.87 12.72,17.81 EXT_IO.3
RE2  (via drill 0.35)
  Top 0.152: v26.75,29.69 26.75,29.46 32.84,23.37 37.41,23.37 IC4.27 | v19.66,28.78 19.2,28.78 16.84,31.14 13.34,31.14 12.72,31.75 MISC_IO.3
  Bottom 0.152: v26.75,29.69 24.38,32.06 22.94,32.06 v19.66,28.78
RELAY  (via drill 0.35)
  Top 0.152: v39.09,15.82 39.09,20.7 38.1,21.69 37.49,21.69 IC4.25 | v37.72,14.45 32.54,14.45 30.79,16.21 26.75,16.21 25.45,17.5 25.45,17.96 21.79,21.61 21.72,21.61 20.04,23.29 20.04,25.96 v16.08,29.92
  Bottom 0.152: v37.72,14.45 v39.09,15.82 | v16.08,29.92 14.1,27.94 13.95,27.94 12.72,26.72 MISC_IO.1
RLED  (via drill 0.35)
  Top 0.152: v27.2,17.12 27.2,20.32 26.59,20.93 26.06,20.93 IC4.10
  Bottom 0.152: v27.2,17.12 27.2,14.53 24.08,11.4 24.08,5.16 25.07,4.17 25.38,4.17 R8.2
SCK1  (via drill 0.35)
  Top 0.152: v35.74,37.62 36.65,36.7 36.65,29.39 36.12,28.85 33.76,28.85 33.38,29.24 33.38,29.85 IC4.37 33.3,29.92 33.3,30.53 30.18,33.66 29.72,33.66 27.05,36.32 v26.59,36.32 | v47.78,49.66 47.78,54.15 48.23,54.61 DISPLAY.3
  Bottom 0.152: v47.78,49.66 v35.74,37.62 | v26.59,36.32 26.36,36.55 23.62,36.55 22.02,34.95 21.34,34.95 20.95,35.33 20.95,35.94 20.65,36.25 20.04,36.25 19.36,35.56 13.87,35.56 13.79,35.64 11.66,35.64 11.58,35.56 11.2,35.56 9.98,34.34 8.91,34.34 DIGITAL.4
SDI1  (via drill 0.35)
  Top 0.152: v23.62,35.03 24.31,34.34 25.68,34.34 29.34,30.68 29.34,29.92 IC4.42 | v16.69,31.75 14.94,31.75 13.41,33.27 11.51,33.27 10.67,34.11 10.67,35.03 8.91,36.78 DIGITAL.5
  Bottom 0.152: v23.62,35.03 22.86,34.27 19.89,34.27 17.37,31.75 v16.69,31.75
SDO1  (via drill 0.35)
  Top 0.152: v21.34,40.67 21.72,40.67 22.55,39.83 22.55,35.18 23.7,34.04 25.53,34.04 28.5,31.06 28.5,29.92 IC4.43 | v15.62,43.03 15.62,42.65 13.34,40.36 9.91,40.36 8.91,39.37 DIGITAL.6 | v36.73,50.88 37.95,52.09 43.36,52.09 47.32,48.13 48.08,48.13 50.75,50.8 50.75,54.61 DISPLAY.4
  Bottom 0.152: v15.62,43.03 16.69,43.03 19.51,40.21 20.88,40.21 v21.34,40.67 21.34,40.59 21.64,40.28 28.12,40.28 36.73,48.89 v36.73,50.88
UC_RX  (via drill 0.35)
  Top 0.152: v18.97,34.27 18.97,31.37 22.17,28.17 25.98,28.17 IC4.1 | v20.34,35.64 20.34,40.74 v20.42,40.82 | v16.08,45.16 14.17,45.16 13.34,46 11.51,46 10.67,46.84 10.67,47.75 DIGITAL.10
  Bottom 0.152: v20.34,35.64 v18.97,34.27 | v16.08,45.16 v20.42,40.82
UC_TX  (via drill 0.35)
  Top 0.152: v21.87,36.47 22.25,36.09 22.25,35.03 23.55,33.73 25.38,33.73 27.74,31.37 27.74,29.92 IC4.44
  Bottom 0.152: v21.87,36.47 18.44,39.9 16.92,39.9 14.78,42.04 14.78,42.49 14.1,43.18 13.79,43.18 13.72,43.26 11.66,43.26 11.58,43.18 11.28,43.18 10.06,41.96 8.91,41.96 DIGITAL.7
V+
  Top 0.305: R12.2 48.46,34.27 48.46,24.13 53.34,19.25 PVP_0.2 52.12,15.29 52.12,9.96 PVP_90.2
VDD  (via drill 0.35)
  Top 0.152: C18.1 37.8,46.99 37.8,50.19 38.41,50.8 C4.1 | 31.51,48.02 33.3,49.81 34.21,49.81 35.2,50.8 R6.2 35.28,50.8 35.81,50.27 37.8,50.27 C4.1 | 31.51,48.02 30.86,47.37 30.86,46.99 C19.1 | 31.51,48.02 v31.24,48.28 | MODBUS.5 21.64,54.61 23.09,53.16 26.36,53.16 v28.96,50.57 28.88,50.57 v28.88,44.25 | v52.81,32.28 55.85,35.33 55.85,38.08 IC2.3 55.93,38.15 55.93,40.28 58.98,43.33 58.98,52.02 v57.53,53.47 | 56.16,48.28 56.16,54.38 55.93,54.61 DISPLAY.6 | 56.16,48.28 56.16,46.99 C13.1 | 56.16,48.28 50.67,48.28 49.38,46.99 CAN_PWR.2 47.7,46.99 47.7,47.3 43.2,51.79 39.47,51.79 38.48,50.8 C4.1 | v33.76,23.98 33.91,24.13 IC4.28 38.56,24.13 40.31,22.38 v40.31,15.06 | 10.44,12.7 10.44,8.74 10.21,8.51 OS1_10MHZ.4 10.44,8.66 11.51,8.66 13.11,7.06 13.11,6.45 10.97,4.32 10.21,4.32 OS1_10MHZ.1 | 10.44,12.7 6.63,16.51 6.63,18.42 3.81,21.23 ANALOG.8 3.81,21.92 1.75,23.98 1.75,30.15 v1.98,30.38 | 10.44,12.7 C3.1 | 16.76,44.55 16.76,43.18 C2.1 16.84,41.96 v16.92,41.89 | 16.76,44.55 16.76,45.39 15.62,46.53 15.62,46.99 R2.1 | 16.76,44.55 15.01,44.55 13.87,43.41 9.91,43.41 8.91,44.4 DIGITAL.8 7.62,43.18 ICSP.2 1.75,41.12 1.75,32.44 v2.9,31.29 | 25.3,41.5 25.3,42.49 IC3.2 | 25.3,41.5 25.3,41.28 | v21.18,27.18 24.99,23.37 25.98,23.37 IC4.7 | v23.85,31.44 23.62,31.44 19.43,35.64 19.43,39.37 | 25.3,41.5 20.19,41.5 19.43,40.74 19.43,40.67 | 19.43,39.37 19.43,40.67 | 25.3,41.5 IC3.3 | 19.43,39.37 C12.1 | 19.43,40.67 v18.14,40.67 | v32.99,33.05 32.99,35.33 31.47,36.86 29.79,36.86 26.59,40.06 26.59,40.51 25.98,41.12 | 25.98,41.12 25.83,41.28 25.3,41.28 | 25.3,41.28 IC3.3 | 25.98,41.12 v26.59,41.73
  Top 0.152: 25.98,41.12 IC3.3
  Bottom 0.152: v31.24,48.28 v28.96,50.57 | v52.81,32.28 51.74,31.22 51.74,30.53 ZENER.C | v57.53,53.47 56.39,54.61 DISPLAY.6 | C11.1 32.69,22.91 v33.76,23.98 32.77,24.97 32.77,26.64 C6.1 32.69,26.72 C5.1 32.77,31.75 32.77,32.82 v32.99,33.05 | TTL_SERIAL.4 38.18,12.78 38.18,13 38.94,13.77 39.01,13.77 v40.31,15.06 | v21.18,27.18 21.18,28.78 v23.85,31.44 | v18.14,40.67 v16.92,41.89 | v2.9,31.29 v1.98,30.38 | v28.88,44.25 28.88,44.02 v26.59,41.73
VREF  (via drill 0.35)
  Top 0.152: v31.55,7.75 33.68,9.88 37.49,9.88 39.4,11.79 39.4,14.61 38.02,15.98 37.03,15.98 35.81,17.2 35.81,18.34 IC4.22 | v25.3,7.29 18.67,7.29 15.54,10.41 14.94,10.41 13.72,9.2 13.72,5.31 10.67,2.26 9.68,2.26 5.56,6.38 5.56,7.14 ANALOG.3
  Bottom 0.152: v31.55,7.75 31.09,7.29 v25.3,7.29
VSS  (via drill 0.35)  (5 unrouted)
  Top 0.152: IC3.15 30.71,42.57 30.71,43.79 IC3.16 30.71,43.87 30.71,44.7 30.75,44.74 | 30.75,44.74 32.69,46.69 C19.2 C18.2 35.89,46.69 38.79,43.79 39.55,43.79 39.59,43.75 | 42.82,46.99 42.82,48.36 40.39,50.8 C4.2 | 42.82,46.99 39.59,43.75 | 39.59,43.75 39.55,43.71 39.55,42.57 U2.8 | 42.82,46.99 C1.2 | C2.2 19.74,43.18 20,43.45 | 20,43.45 21.11,44.55 24.54,44.55 25.22,43.87 IC3.1 | LED1.C 21.64,6.15 v23.47,6.15 25.38,6.15 LED2.C 25.45,6.07 26.14,5.39 27.36,5.39 28.04,6.07 29.18,6.07 LED3.C | 40.08,38.68 39.55,38.68 U2.5 40.08,38.68 | 40.08,38.68 40.84,38.68 42.67,36.86 42.82,36.86 C14.2 | 33.11,40.47 33.91,41.28 U2.2 | 33.11,40.47 32.69,40.06 30.71,40.06 IC3.13 | IC3.10 30.71,36.17 30.71,34.95 IC3.9 30.79,34.95 v32,34.95 | IC4.6 27.96,24.13 29.18,25.35 v29.21,25.4 | v36.2,24.89 37.41,24.89 IC4.29 | EXT_IO.1 7.62,17.65 12.34,12.93 12.34,12.7 C3.2 | C12.2 21.26,35.86 21.57,35.56 v21.59,35.56 | R1.2 22.48,46.99 21.49,46 19.89,46 19.74,46.15 19.74,48.97 20.27,49.5 CANBUS.2 | PVP_0.10 42.29,28.47 42.82,29.01 42.82,34.27 C7.2 42.75,34.27 41.68,35.33 40.69,35.33 40.08,35.94 40.08,38.68 | C15.2 53.03,34.34 53.03,37.77 53.34,38.08 IC2.2 53.34,38.15 58.06,42.88 58.06,46.99 C13.2 | IC3.8 25.3,34.87 26.06,34.87 27.89,33.05 v27.94,33.02 | v32,38.76 30.71,38.76 IC3.12 | MODBUS.1 10.21,53.39 5.87,53.39 RESET.2 | v15.24,5.61 OS1_10MHZ.2 | 33.11,40.47 32.92,40.67 v32.84,40.67 | v19.96,43.48 20,43.45 | 30.75,44.74 29.57,45.92 29.57,53.01 27.96,54.61 R_RESET.1
  other vias: 19.05,21.59
  pour Bottom (rank 6, no thermals): 2.54,57.15 59.69,57.15 59.69,1.27 1.27,1.27 1.27,55.88

### Text on the board
Top: Q84 DCU 1.3